# EasyEDA Pro project ProProject_ExtBoard-003_2024-07-01.epro

# Schematic Schematic-CandleLight

## Sheets
1 USB: Create Date: 2024-06-27; Page Name: USB; Project Name: ExtBoard-003; Schematic Name: Schematic-CandleLight; Update Date: 2024-06-27; Company: 嘉立创EDA; Page Size: A4; Version: V1.0
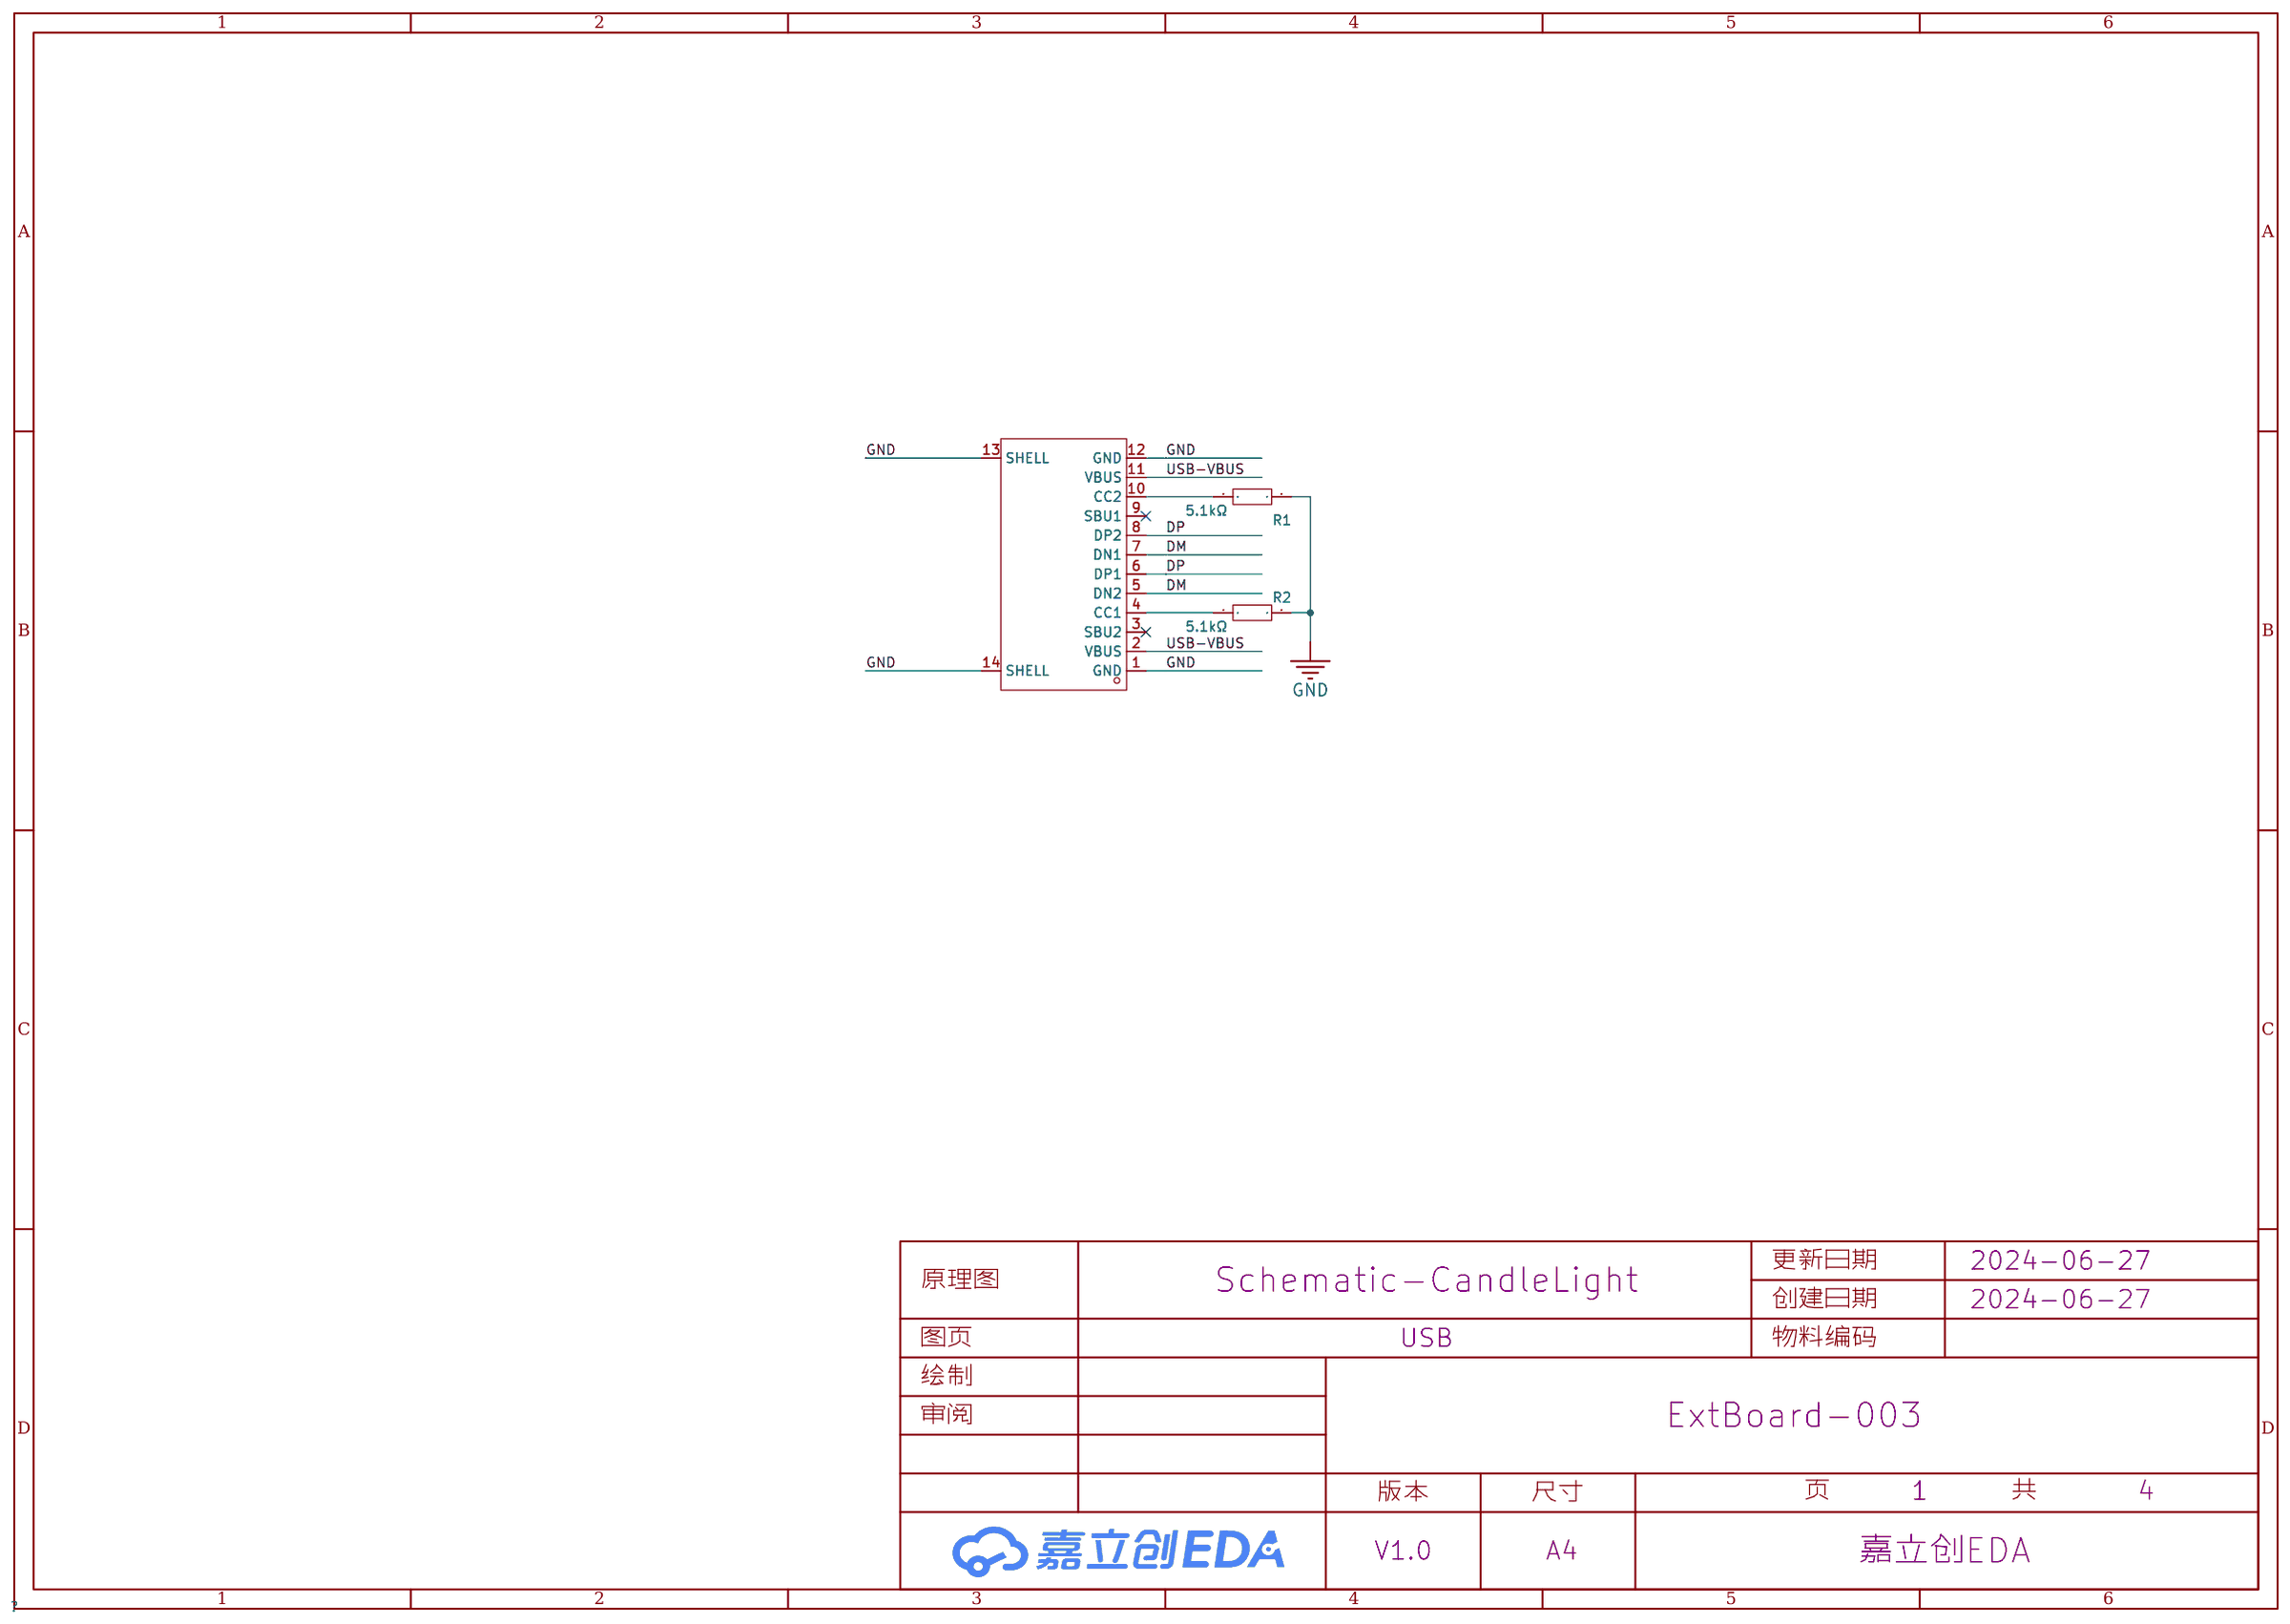
[diagram p0: USB]
2 Power: Page Name: Power
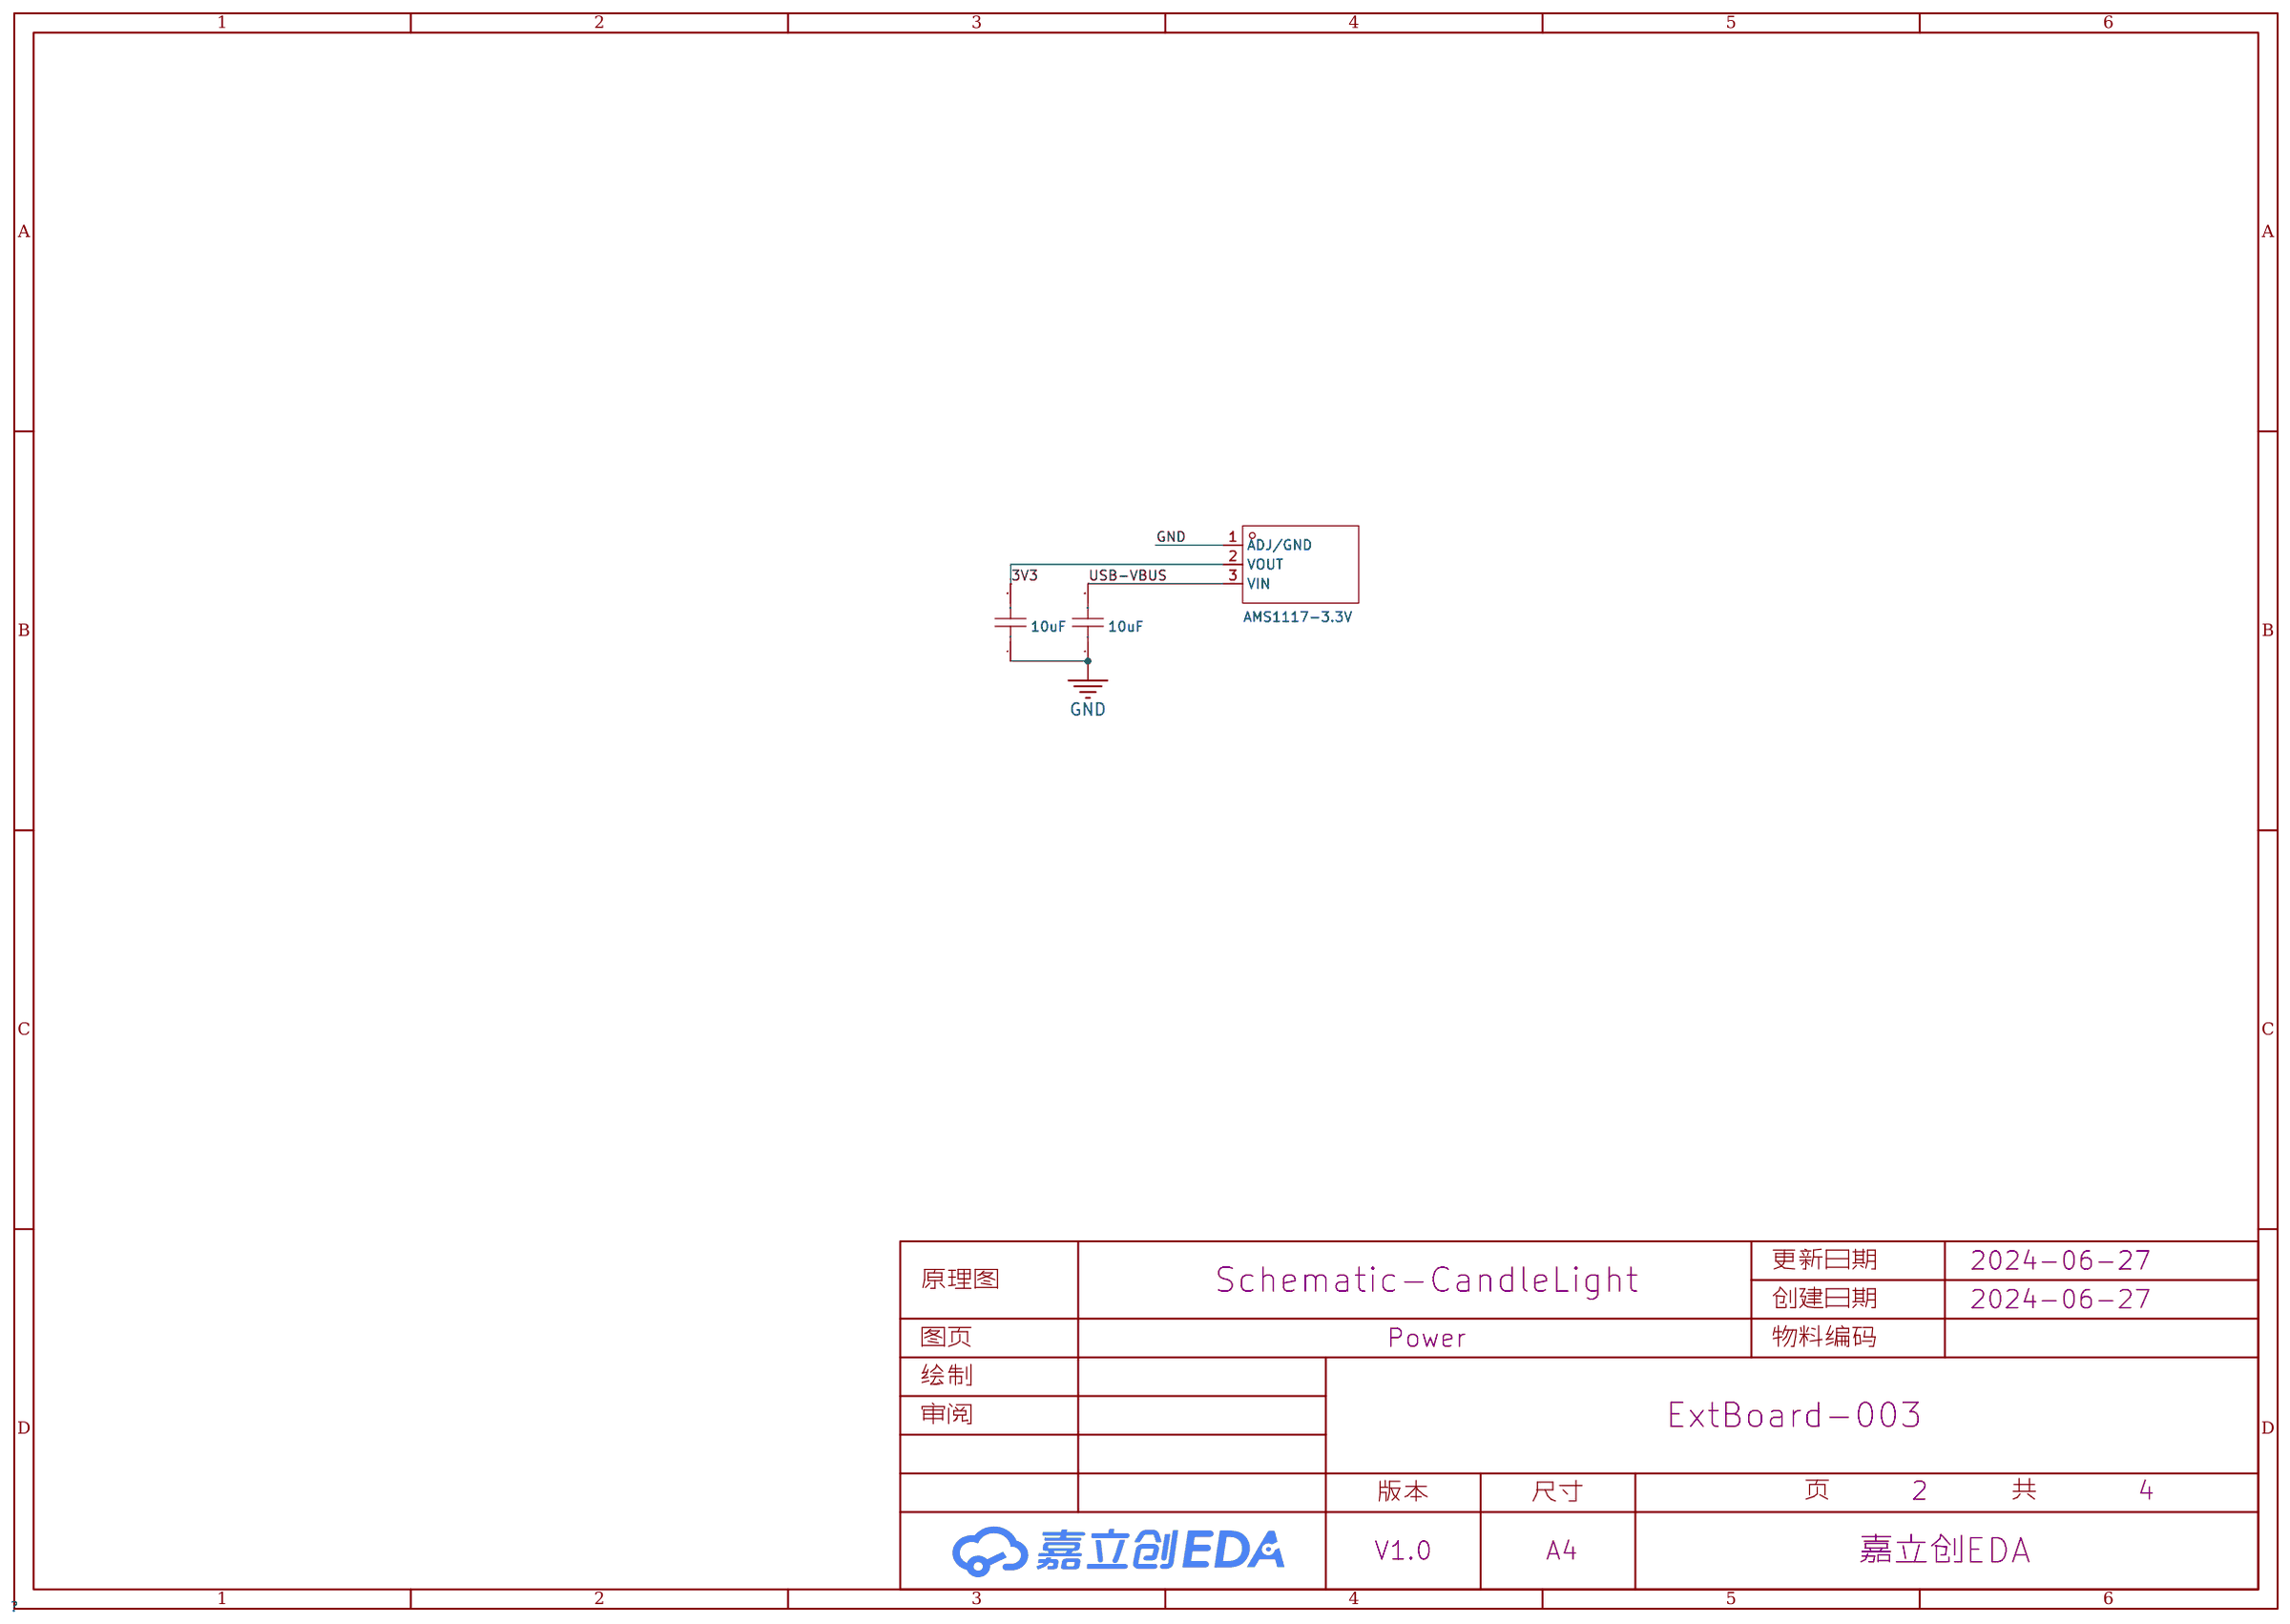
[diagram p1: Power]
3 LED: Page Name: LED
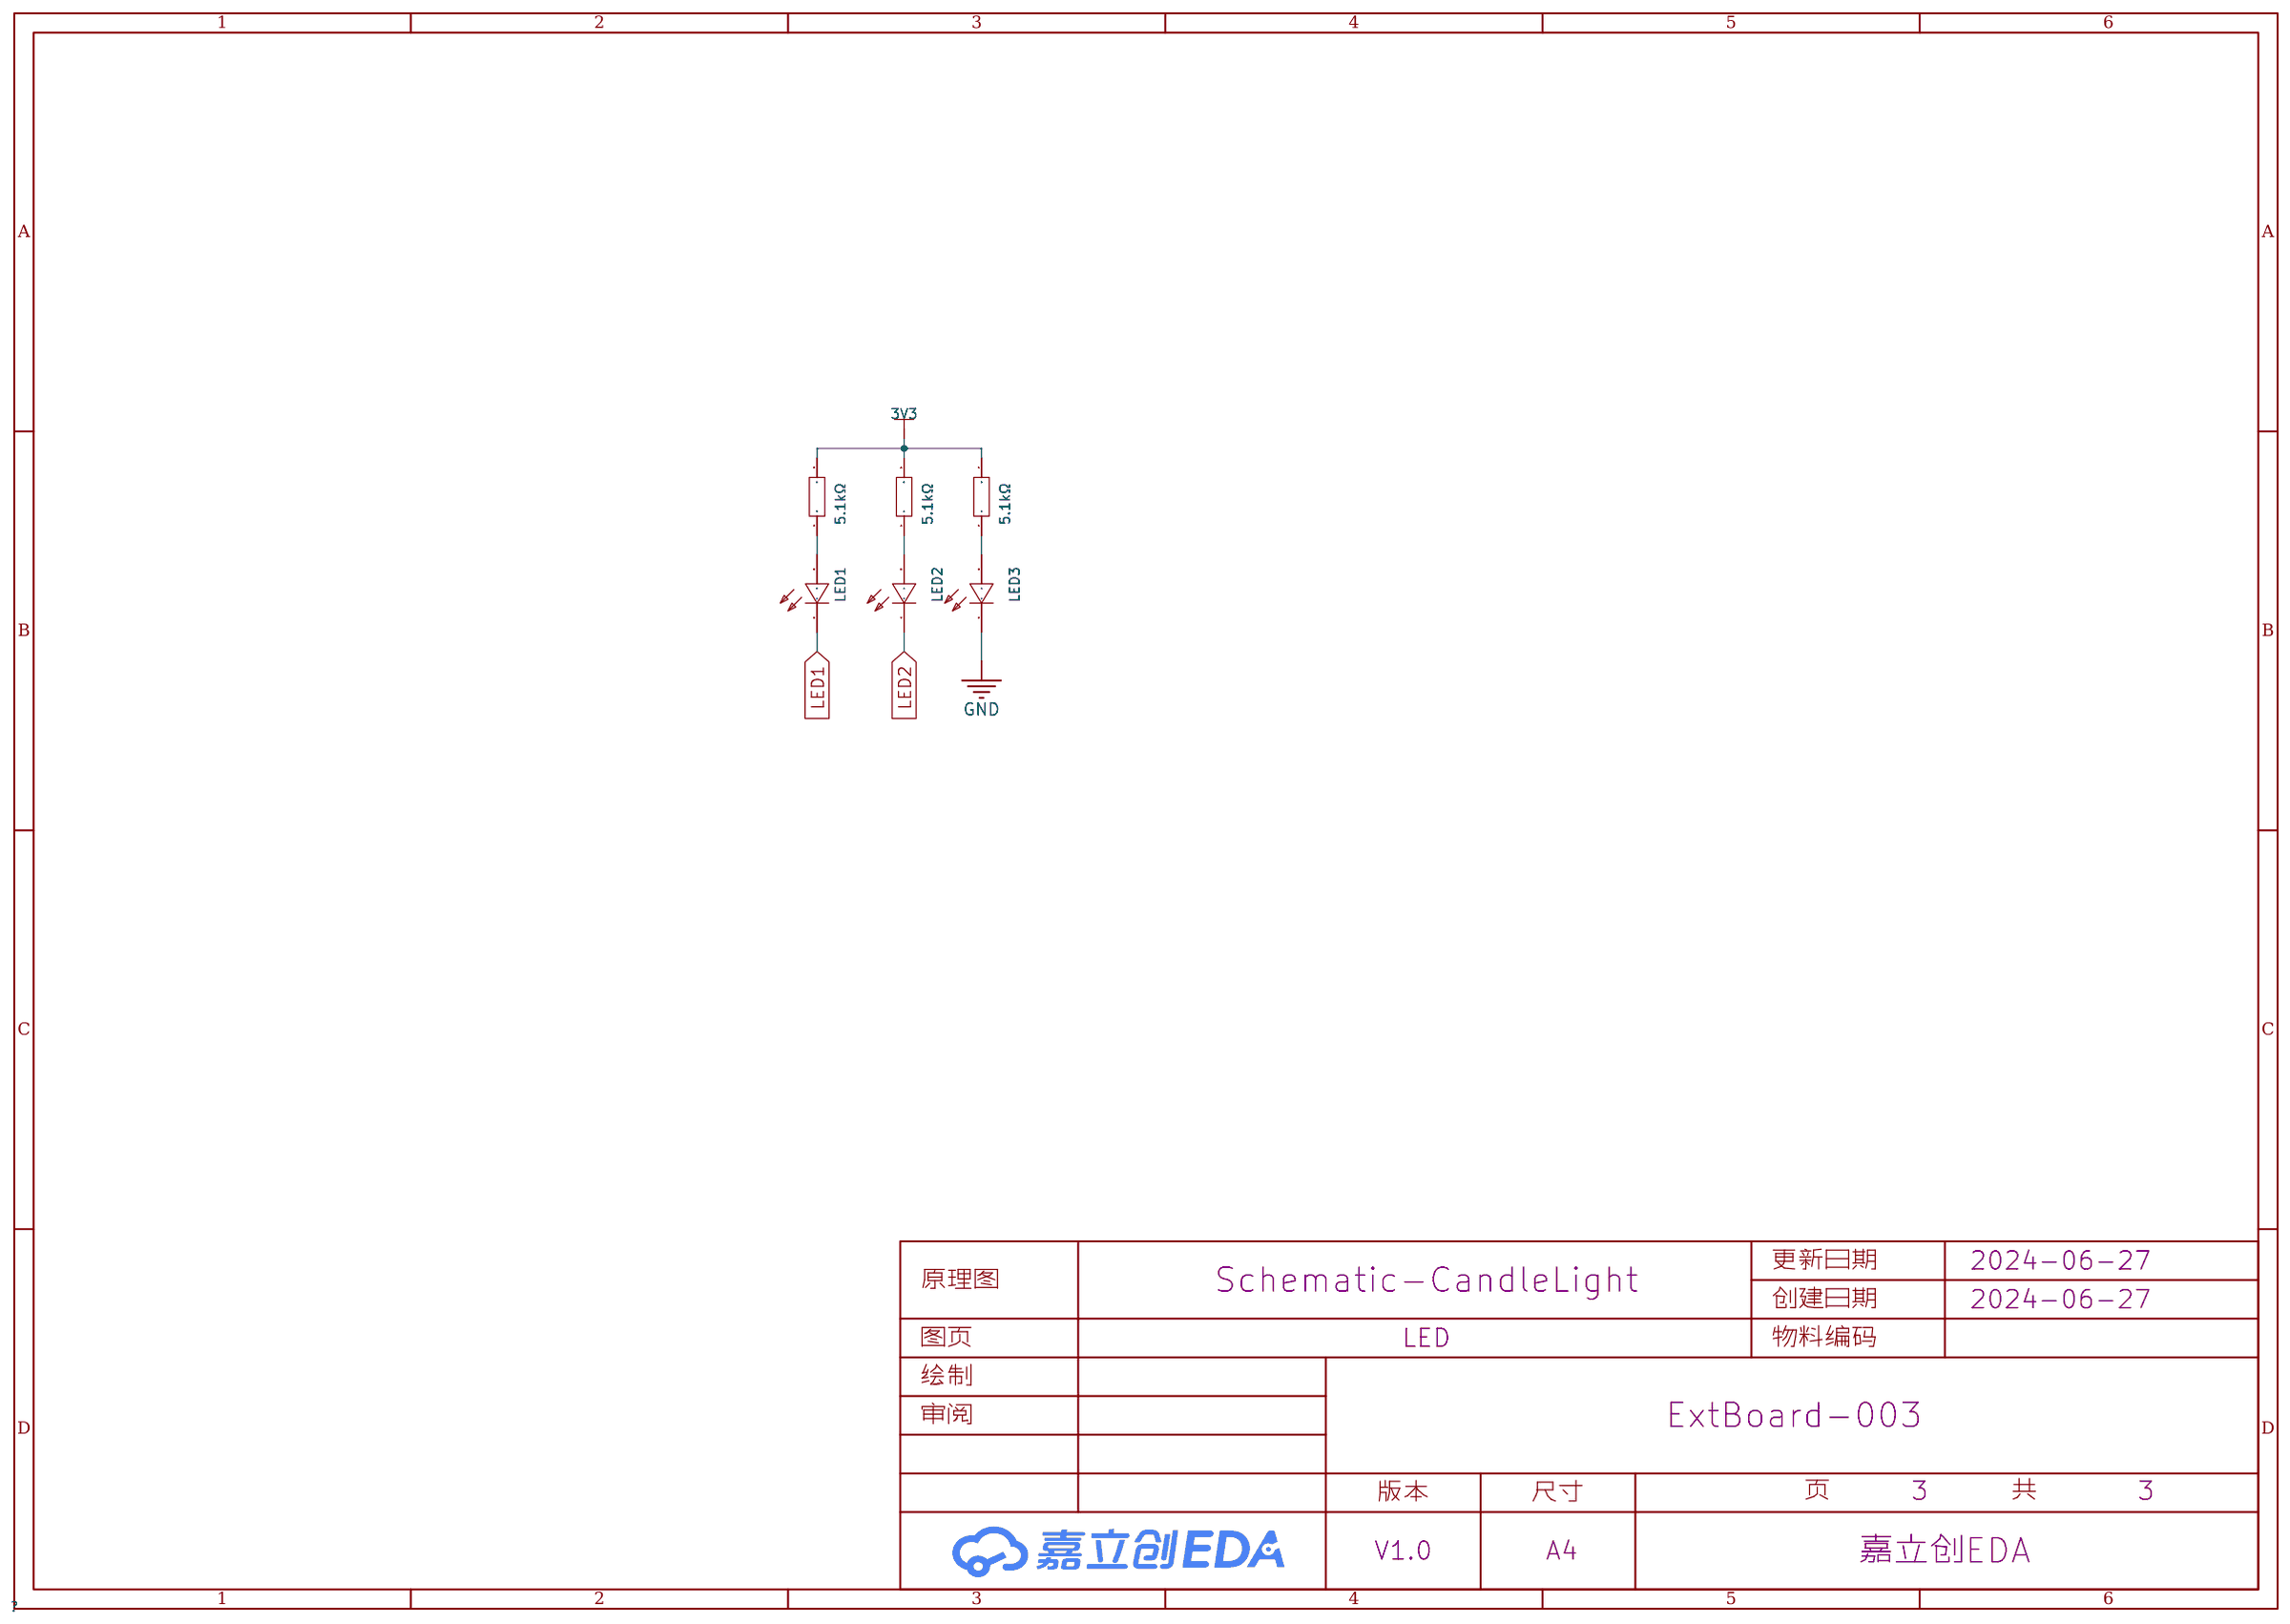
[diagram p2: LED]
4 CAN: Page Name: CAN
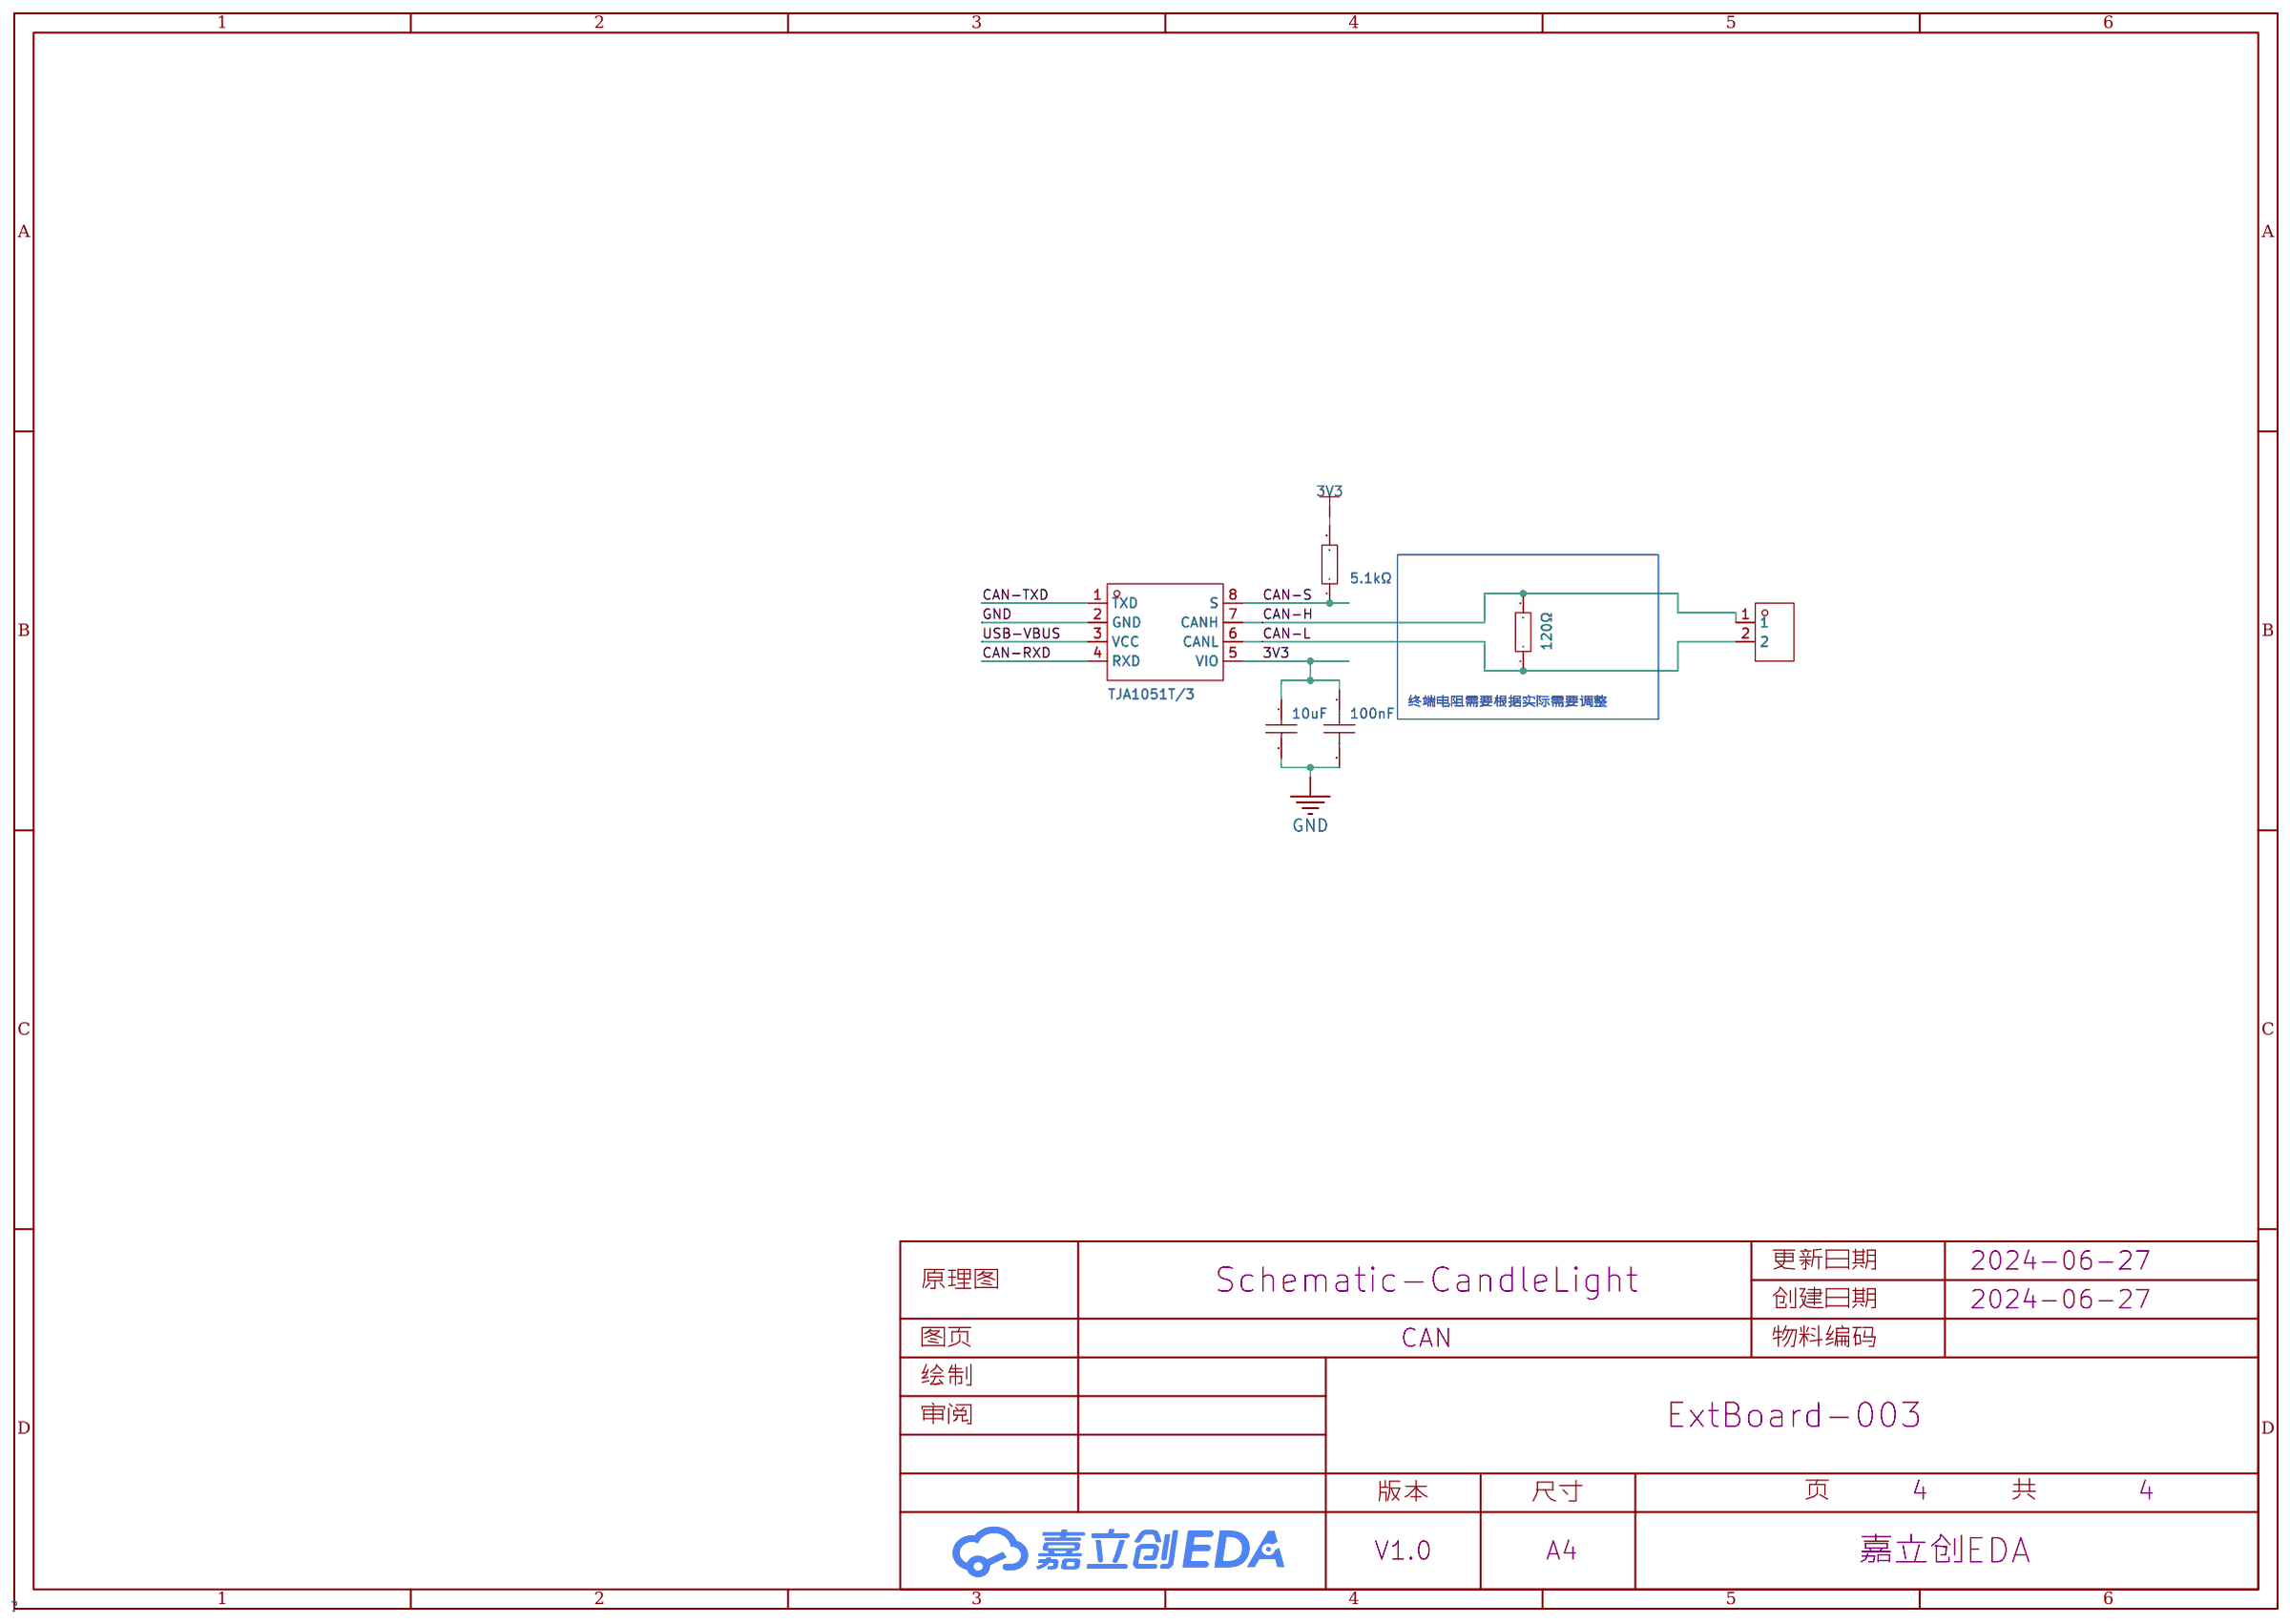
[diagram p3: CAN]
5 MCU: Page Name: MCU
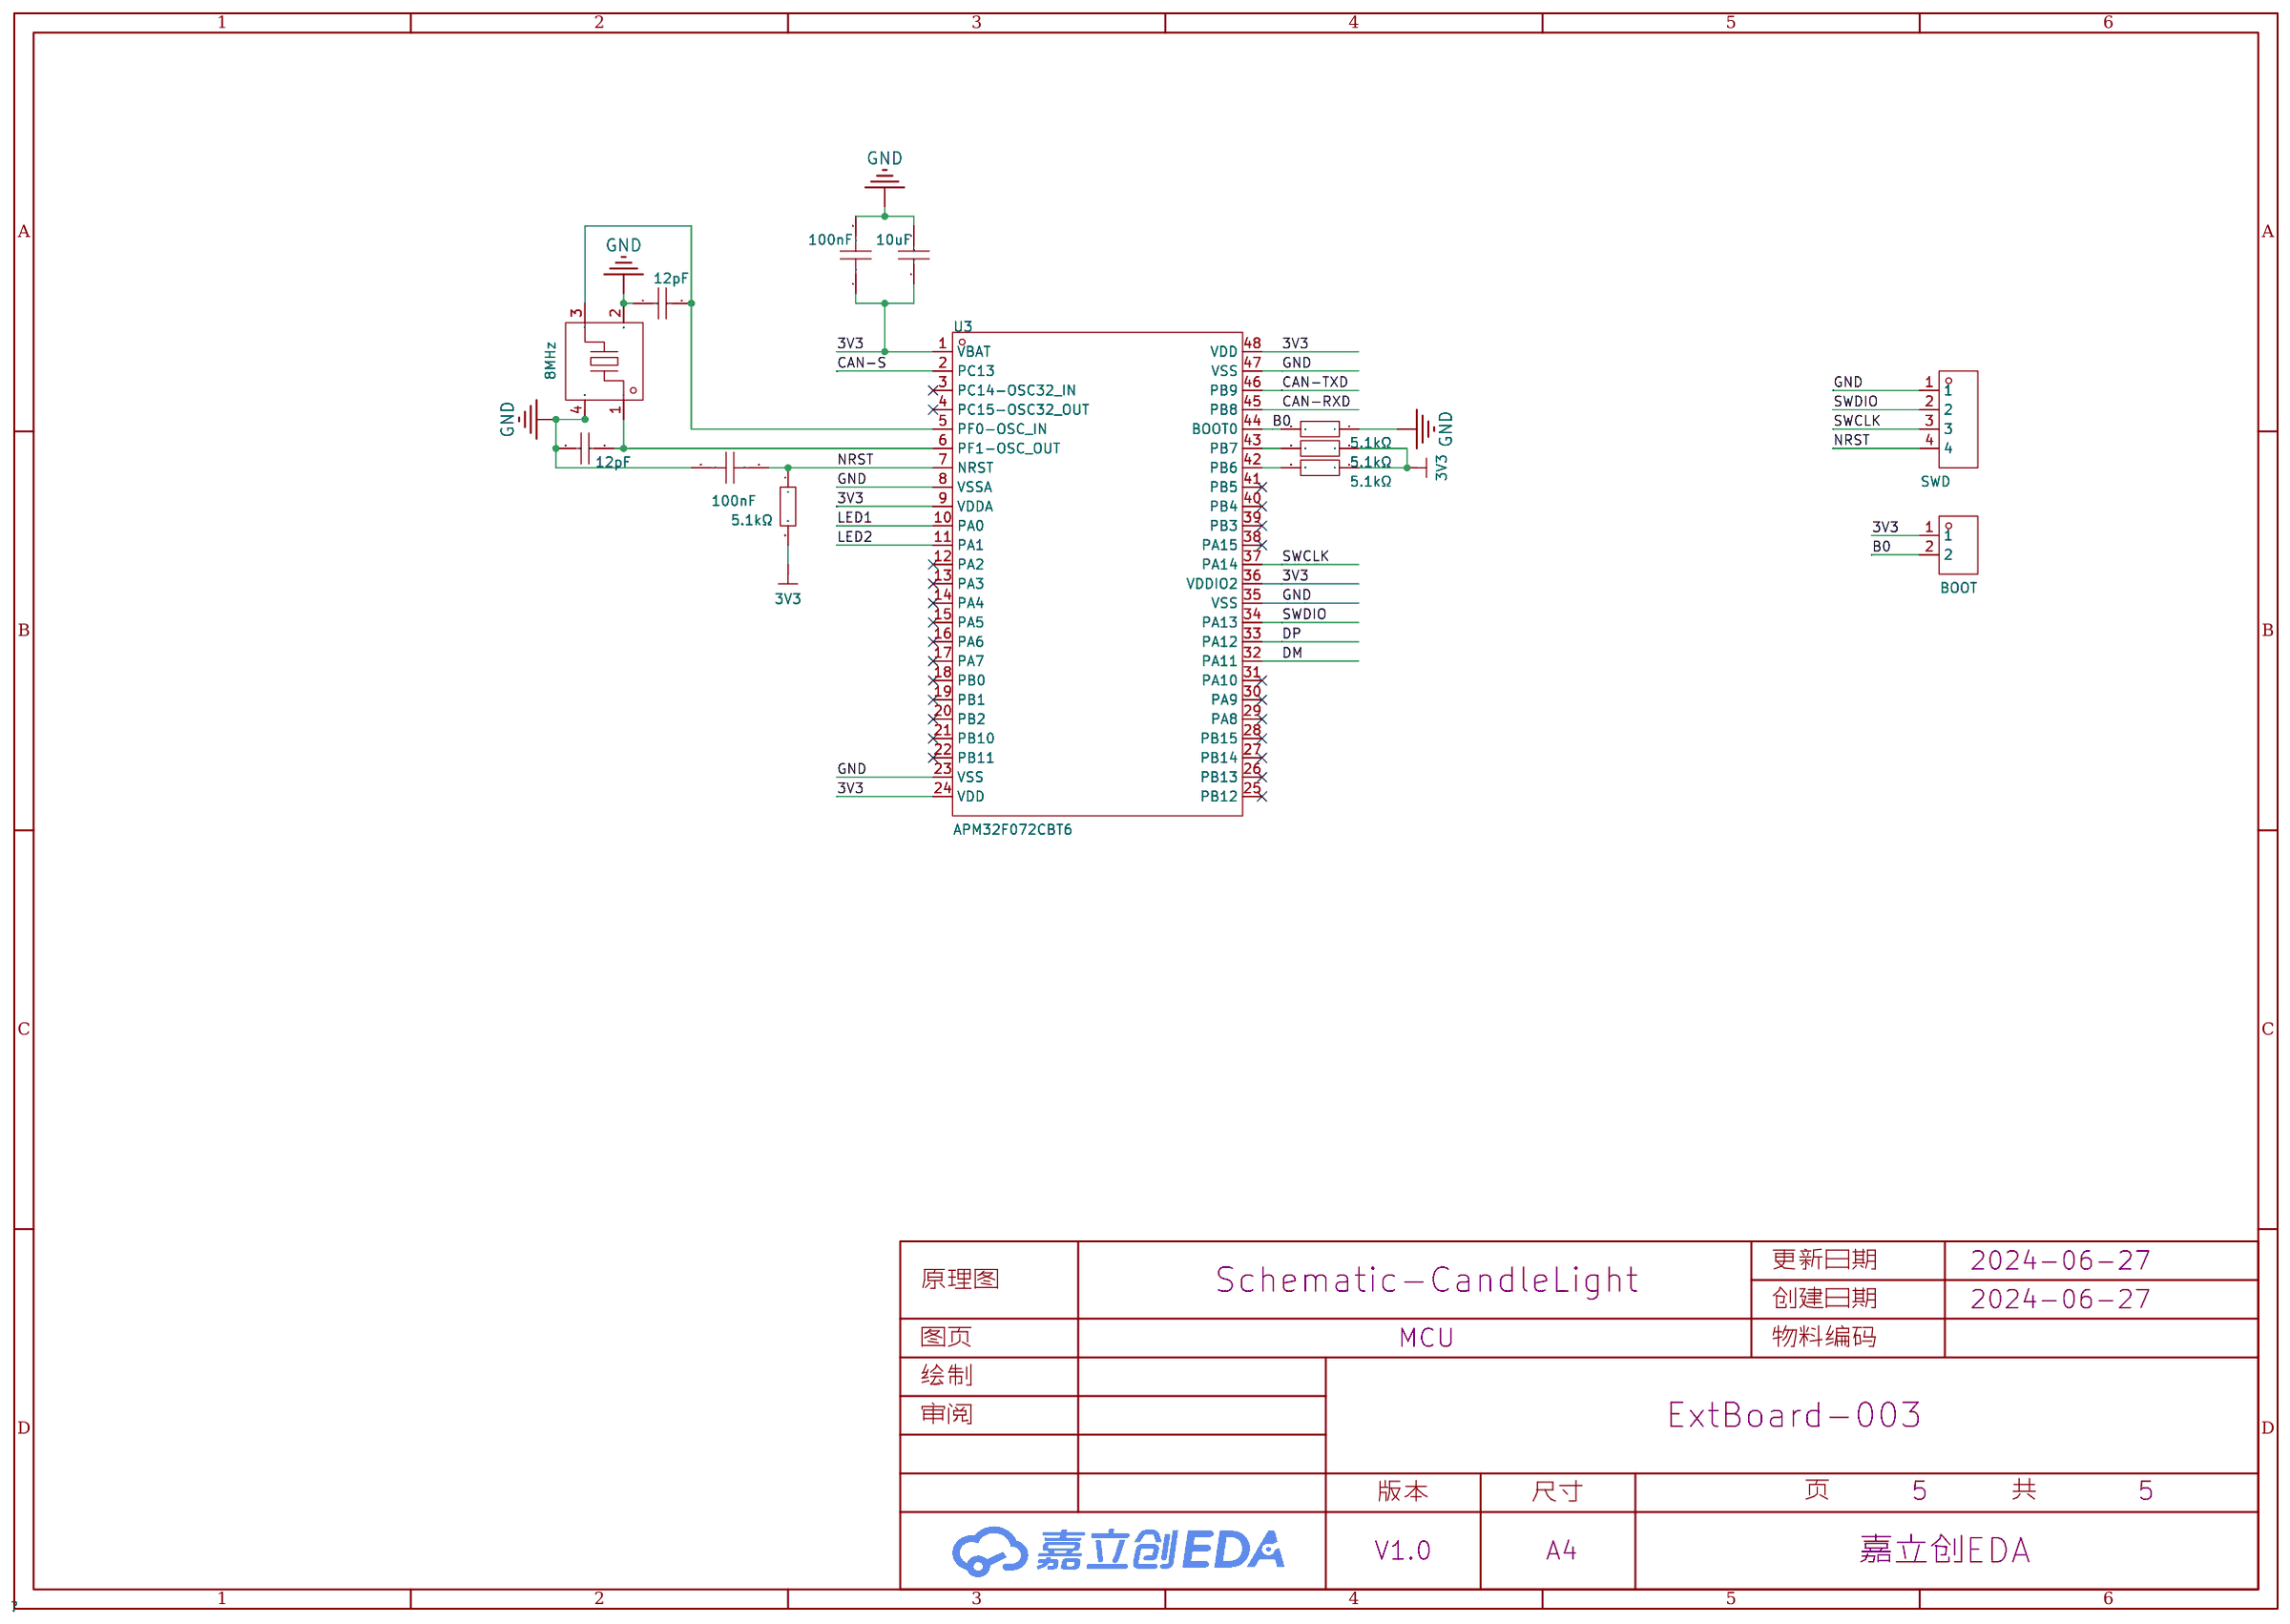
[diagram p4: MCU]

## Parts
sheet CAN
C3  10uF  [C0402]
C4  100nF  [C0402]
R6  5.1kΩ  [R0402]
R7  120Ω  [R1206]
U1  TJA1051T/3  [SOP-8_L4.9-W3.9-P1.27-LS6.0-BL-1]
U2  DB125-3.81-2P-GN-S  [CONN-TH_2P-P3.81_L7.4-W7.6]
sheet LED
LED1  NCD0603R1  [LED0603-RD_RED]
LED2  NCD0603R1  [LED0603-RD_RED]
LED3  NCD0603R1  [LED0603-RD_RED]
R3  5.1kΩ  [R0402]
R4  5.1kΩ  [R0402]
R5  5.1kΩ  [R0402]
sheet MCU
C5  100nF  [C0402]
C6  10uF  [C0402]
C7  12pF  [C0402]
C8  12pF  [C0402]
C9  100nF  [C0402]
H1  SWD  [HDR-TH_4P-P2.54-V-M]
H3  BOOT  [HDR-TH_2P-P1.27-V-M]  (no BOM)
R8  5.1kΩ  [R0402]
R9  5.1kΩ  [R0402]
R10  5.1kΩ  [R0402]
R11  5.1kΩ  [R0402]
U3  APM32F072CBT6  [LQFP-48_L7.0-W7.0-P0.50-LS9.0-BL]
X1  8MHz  [OSC-SMD_4P-L3.2-W2.5-BL]
sheet Power
C1  10uF  [C0402]
C2  10uF  [C0402]
Q1  AMS1117-3.3V  [SOT-89-3_L4.5-W2.5-P1.50-LS4.2-BR]
sheet USB
R1  5.1kΩ  [R0402]
R2  5.1kΩ  [R0402]
USB1  TYPE-C 16PIN 2MD(073)  [USB-C-SMD_TYPE-C-6PIN-2MD-073]

## Library data of the parts
C3 C6 = CL05A106MQ5NUNC: 容值:10uF;精度:±20%;额定电压:6.3V;材质(温度系数):X5R;; LCSC Part Name: 10uF ±20% 6.3V; Supplier Part: C15525; Manufacturer: SAMSUNG(三星); Supplier Footprint: 0402; JLCPCB Part Class: 基础库; Datasheet: https://atta.szlcsc.com/upload/public/pdf/source/20220823/2B02EE04F8F211D38A52DCB16EB6BEBA.pdf; Supplier: LCSC; Tolerance: ±20%; Voltage Rated: 6.3V; Temperature Coefficient: X5R
C4 C5 C9 = CC0402KRX7R7BB104: 容值:100nF;精度:±10%;额定电压:16V;材质(温度系数):X7R;; LCSC Part Name: 100nF ±10% 16V; Supplier Part: C60474; Manufacturer: YAGEO(国巨); Supplier Footprint: 0402; JLCPCB Part Class: Extended Part; Datasheet: https://atta.szlcsc.com/upload/public/pdf/source/20211223/9278FD768280B81DDBEF48FA36411A03.pdf; Supplier: LCSC; Tolerance: ±10%; Voltage Rated: 16V; Temperature Coefficient: X7R
R1-R6 R8-R11 = 0402WGF5101TCE: 阻值:5.1kΩ;精度:±1%;功率:62.5mW;温度系数:±100ppm/℃;电阻类型:厚膜电阻;; LCSC Part Name: 5.1kΩ ±1% 62.5mW 厚膜电阻; Supplier Part: C25905; Manufacturer: UNI-ROYAL(厚声); Supplier Footprint: 0402; JLCPCB Part Class: Basic Part; Datasheet: https://atta.szlcsc.com/upload/public/pdf/source/20200306/C422600_1E6D84923E4A46A82E41ADD87F860B5C.pdf; Supplier: LCSC; Tolerance: ±1%; Power(Watts): 62.5mW; Overload Voltage (Max): 50V; Temperature Coefficient: ±100ppm/℃; Type: 厚膜电阻; Operating Temperature Range: -55℃~+155℃
R7 = 1206W4F1200T5E: 电阻类型:厚膜电阻;阻值:120Ω;精度:±1%;功率:250mW;最大工作电压:200V;温度系数:±100ppm/℃;; LCSC Part Name: 120Ω ±1% 250mW 厚膜电阻; Supplier Part: C17909; Manufacturer: UNI-ROYAL(厚声); Supplier Footprint: 1206; JLCPCB Part Class: 基础库; Datasheet: https://atta.szlcsc.com/upload/public/pdf/source/20200306/C422600_1E6D84923E4A46A82E41ADD87F860B5C.pdf; Supplier: LCSC; Type: 厚膜电阻; Tolerance: ±1%; Power(Watts): 250mW; Overload Voltage (Max): 200V; Temperature Coefficient: ±100ppm/℃; Operating Temperature Range: -55℃~+155℃
U1 = TJA1051T/3: LCSC Part Name: CAN芯片; Supplier Part: C5342108; Manufacturer: Tokmas(托克马斯); Supplier Footprint: SOP-8; JLCPCB Part Class: 扩展库; Datasheet: https://atta.szlcsc.com/upload/public/pdf/source/20221230/A2F88B671123D34174A4F40D8F54A86B.pdf; Supplier: LCSC
U2 = DB125-3.81-2P-GN-S: 结构:1x2P;间距:3.81mm;颜色:绿色;安装方式:直插;额定电流:10A;额定电压:300V;排数:1;线规 - AWG:16~26;线规 - 平方毫米:0.5~1;每排PIN数:2;工作温度范围:-40℃~+105℃;; LCSC Part Name: 3.81mm 1x2P 排数:1 每排P数:2 直插; Supplier Part: C395878; Manufacturer: DORABO(地博电气); Supplier Footprint: 插件,P=3.81mm; JLCPCB Part Class: 扩展库; Datasheet: https://atta.szlcsc.com/upload/public/pdf/source/20220823/CB89165D0F406880B925A92BEEA3FB50.pdf; Supplier: LCSC; Structure: 1x2P; Pitch: 3.81mm; Color: 绿色; Mounting Style: 直插; Current Rating (Max): 10A; Voltage Rating (Max): 300V; Number of Pins: 2P; Number of Rows: 1; Wire Gauge - AWG: 16~26; Wire Gauge - mm2: 0.5~1; Number of PINs Per Row: 2; Operating Temperature Range: -40℃~+105℃
LED1-LED3 = NCD0603R1_C84263: 灯头类型:-;发光颜色:红色;正向电压(VF):1.6V~2.6V;功率:65mW;正向电流:20mA;主波长:615nm~630nm;二极管配置:独立二极管;透镜颜色:无色透明透镜;色温:-;发光强度:80mcd~220mcd;发光角度:130°;载带方式:-;工作温度:-30℃~+85℃;; Supplier Part: C84263; Manufacturer: 国星光电; Supplier Footprint: 0603; JLCPCB Part Class: 扩展库; Datasheet: https://atta.szlcsc.com/upload/public/pdf/source/20200820/C84263_DABC6A75E58F576973B407FDBA283D60.pdf; Supplier: LCSC; Emitted Color: 红色; Forward Voltage (VF): 1.6V~2.6V; Power Dissipation: 65mW; Forward Current: 20mA; Dominant Wavelength: 615nm~630nm; Diode Configuration: 独立二极管; Lens Color: 无色透明透镜; Luminous Intensity: 80mcd~220mcd; Viewing Angle: 130°; Operating Temperature: -30℃~+85℃
C7 C8 = 0402CG120J500NT: 容值:12pF;精度:±5%;额定电压:50V;材质(温度系数):C0G;; LCSC Part Name: 12pF ±5% 50V; Supplier Part: C1547; Manufacturer: FH(风华); Supplier Footprint: 0402; JLCPCB Part Class: 基础库; Datasheet: https://atta.szlcsc.com/upload/public/pdf/source/20200305/C486355_26A10D38EF8C2A5C37091D0039909270.pdf; Supplier: LCSC; Tolerance: ±5%; Voltage Rated: 50V; Temperature Coefficient: C0G
H1 = PZ254V-11-04P: 插针结构:1x4P;间距:2.54mm;行距:-;圆针/方针:方针;安装类型:直插;排数:单排;总PIN位数:4P;额定电流:3A;额定电压:250V;配合针长度:6mm;塑高:2.5mm;端接针长度:3mm;触头材质:-;工作温度范围:-40℃~+105℃;颜色:黑色;; LCSC Part Name: 间距:2.54mm 1x4P 直插 方针; Supplier Part: C2691448; Manufacturer: XFCN(兴飞); Supplier Footprint: 插件,P=2.54mm; JLCPCB Part Class: 扩展库; Datasheet: https://atta.szlcsc.com/upload/public/pdf/source/20200309/C492403_F9F19131791D08044AD4F84F8E751A34.pdf; Supplier: LCSC; Pin Structure: 1x4P; Pitch: 2.54mm; Circluar Pins/Square Pins: 方针; Mounting Type: 直插; Number of Rows: 单排; Number of Pins: 4P; Current Rating (Max): 3A; Voltage Rating (Max): 250V; Length of Mating Pin: 6mm; Insulation Height: 2.5mm; Length of End Connection Pin: 3mm; Operating Temperature Range: -40℃~+105℃; Color: 黑色
H3 = 1.27-1*2P针: 插针结构:1x2P;间距:1.27mm;行距:-;圆针/方针:方针;安装类型:直插;排数:单排;总PIN位数:2P;额定电流:3A;额定电压:-;配合针长度:3mm;塑高:1.7mm;端接针长度:2.5mm;触头材质:黄铜;触头镀层:-;工作温度范围:-55℃~+105℃;颜色:黑色;; LCSC Part Name: 间距:1.27mm 1x2P 直插 方针; Supplier Part: C703015; Manufacturer: BOOMELE(博穆精密); Supplier Footprint: 插件,P=1.27mm; JLCPCB Part Class: 扩展库; Datasheet: https://atta.szlcsc.com/upload/public/pdf/source/20210902/5C150484D45C6948DF4AB04E914DF562.pdf; Supplier: LCSC; Pin Structure: 1x2P; Pitch: 1.27mm; Circluar Pins/Square Pins: 方针; Mounting Type: 直插; Number of Rows: 单排; Number of Pins: 2P; Current Rating (Max): 3A; Length of Mating Pin: 3mm; Insulation Height: 1.7mm; Length of End Connection Pin: 2.5mm; Contact Material: 黄铜; Operating Temperature Range: -55℃~+105℃; Color: 黑色
U3 = APM32F072CBT6: CPU内核:CM0;程序存储容量:128KB;RAM总容量:16KB;GPIO端口数量:37;工作电压范围:2V~3.6V;CPU最大主频:48MHz;程序存储器类型:FLASH;; Supplier Part: C915660; Manufacturer: Geehy(珠海极海); Supplier Footprint: LQFP-48(7x7); JLCPCB Part Class: 扩展库; Datasheet: https://atta.szlcsc.com/upload/public/pdf/source/20201105/C915660_4FC6DFA7AB6BE04AE7EC96004DE2A55F.pdf; Supplier: LCSC; CPU Core: CM0; Program Storage Size: 128KB; RAM Size: 16KB; GPIO Ports Number: 37; Operating Voltage Range: 2V~3.6V; CPU Maximum Speed: 48MHz; Program Memory Type: FLASH; Operating Temperature Range: -40℃~+85℃; ADC (Bit): 12bit; DAC (Bit): 12bit; PWM (Bit): 16bit; 16Bit Timer: 7; 32Bit Timer: 1; CAN: 1; UART/USART: 4; I2C: 2; SPI: 2; Universal Serial Bus: 有; Internal Comparator: 有; Peripheral/Function: 低电压检测；看门狗；CCP捕获/比较；LIN总线协议；触控按键；片载温度传感器；IrDA；CRC校验；DMA；RTC实时时钟; Watchdog: 有; Real-Time Clock: 有; Infrared Data Association: 有; Low-Voltage Detect: 有; CCP Capture/Compare: 有; Direct Memory Access: 有; Internal Oscillator: 有
X1 = X32258MOB4SI: 晶振类型:贴片晶振;频率:8MHz;常温频差:±10ppm;外接负载电容:12pF;频率稳定度(全温):±30ppm;; LCSC Part Name: 8MHz ±10ppm 12pF; Supplier Part: C2682775; Manufacturer: YXC(扬兴晶振); Supplier Footprint: SMD3225-4P; JLCPCB Part Class: 扩展库; Datasheet: https://atta.szlcsc.com/upload/public/pdf/source/20210106/C2682774_0CD4FDA5D9DA3FBEEC23BD607A48E4B0.pdf; Supplier: LCSC; Crystal Type: 贴片晶振; Normal temperature Frequency Tolerance: ±10ppm; External load capacitor: 12pF; Frequency Stability(Full temperature range): ±30ppm; Equivalent Series Resistance (ESR): 150Ω; Operating Temperature: -40℃~+85℃
C1 C2 = GRM155R61A106ME44D: 容值:10uF;精度:±20%;额定电压:10V;材质(温度系数):X5R;; LCSC Part Name: 10uF ±20% 10V; Supplier Part: C77000; Manufacturer: muRata(村田); Supplier Footprint: 0402; Datasheet: https://atta.szlcsc.com/upload/public/pdf/source/20180530/C77000_4866797CFE3A842CD03C597EBD6AE6CD.pdf; Supplier: LCSC; Tolerance: ±20%; Voltage Rated: 10V; Temperature Coefficient: X5R
Q1 = AMS1117-3.3V_C5120796: 输出类型:固定;输出极性:正;最大输入电压:18V;输出电压:3.3V;输出电流:1A;; Supplier Part: C5120796; Manufacturer: MSKSEMI(美森科); Supplier Footprint: SOT-89; Datasheet: https://atta.szlcsc.com/upload/public/pdf/source/20220727/5E62EAC46FFFF83337622C0FBE1B6BF8.pdf; Supplier: LCSC; Output Type: 固定; Output Polarity: 正; Number of Outputs: 1; Maximum Input Voltage: 18V; Output Voltage: 3.3V; Dropout Voltage: 1.4V@(1A); Quiescent Current (Ground Current): 12mA; Output Current: 1A; Operating Temperature: 0℃~+125℃
USB1 = TYPE-C 16PIN 2MD(073): 连接器类型:Type-C;标准:-;公母:母;端口数量:1;触点数量:16P;安装方式:卧贴;额定电流 - 电源:5A;工作温度范围:-25℃~+85℃;; LCSC Part Name: Type-C 母 卧贴 带定位柱 不锈钢外壳 2次模顶; Supplier Part: C2765186; Manufacturer: SHOU HAN(首韩); Supplier Footprint: SMD; JLCPCB Part Class: 扩展库; Datasheet: https://atta.szlcsc.com/upload/public/pdf/source/20211123/39B17C16241EAC15C5E277BDA434118E.pdf; Supplier: LCSC; Connector Type: Type-C; Gender: 母; Number of Ports: 1; Number of Contacts: 16P; Mounting Style: 卧贴; Current Rating - Power (Max): 5A; Operating Temperature Range: -25℃~+85℃

## Nets
3V3: C1.2 C3.1 C4.1 C5.1 C6.1 H3.1 Q1.2(VOUT) R3.2 R4.2 R5.2 R6.2 R9.1 R10.1 R11.2 U1.5(VIO) U3.1(VBAT) U3.9(VDDA) U3.24(VDD) U3.36(VDDIO2) U3.48(VDD)
GND: C1.1 C2.1 C3.2 C4.2 C5.2 C6.2 C7.1 C8.1 C9.2 H1.1 LED3.1(K) Q1.1(ADJ/GND) R1.2 R2.2 R8.1 U1.2(GND) U3.8(VSSA) U3.23(VSS) U3.35(VSS) U3.47(VSS) USB1.1(GND) USB1.12(GND) USB1.13(SHELL) USB1.14(SHELL) X1.2(GND) X1.4(GND)
B0: H3.2 R8.2 U3.44(BOOT0)
CAN-H: R7.2 U1.7(CANH) U2.1
CAN-L: R7.1 U1.6(CANL) U2.2
CAN-RXD: U1.4(RXD) U3.45(PB8)
CAN-S: R6.1 U1.8(S) U3.2(PC13)
CAN-TXD: U1.1(TXD) U3.46(PB9)
DM: U3.32(PA11) USB1.5(DN2) USB1.7(DN1)
DP: U3.33(PA12) USB1.6(DP1) USB1.8(DP2)
LED1: LED1.1(K) U3.10(PA0)
LED2: LED2.1(K) U3.11(PA1)
NRST: C9.1 H1.4 R11.1 U3.7(NRST)
SWCLK: H1.3 U3.37(PA14)
SWDIO: H1.2 U3.34(PA13)
USB-VBUS: C2.2 Q1.3(VIN) U1.3(VCC) USB1.2(VBUS) USB1.11(VBUS)
$1N217: R1.1 USB1.10(CC2)
$1N218: R2.1 USB1.4(CC1)
$3N372: LED1.2(A) R3.1
$3N375: LED2.2(A) R4.1
$3N378: LED3.2(A) R5.1
$5N578: C7.2 U3.5(PF0-OSC_IN) X1.3
$5N591: C8.2 U3.6(PF1-OSC_OUT) X1.1
$5N836: R9.2 U3.43(PB7)
$5N839: R10.2 U3.42(PB6)

Not connected (* = marked no-connect by the designer): U3 3(PC14-OSC32_IN)* 4(PC15-OSC32_OUT)* 12(PA2)* 13(PA3)* 14(PA4)* 15(PA5)* 16(PA6)* 17(PA7)* 18(PB0)* 19(PB1)* 20(PB2)* 21(PB10)* 22(PB11)* 25(PB12)* 26(PB13)* 27(PB14)* 28(PB15)* 29(PA8)* 30(PA9)* 31(PA10)* 38(PA15)* 39(PB3)* 40(PB4)* 41(PB5)*; USB1 3(SBU2)* 9(SBU1)*

## Notes on the sheets
sheet 4
- 终端电阻需要根据实际需要调整

# Board PCB-CandleLight
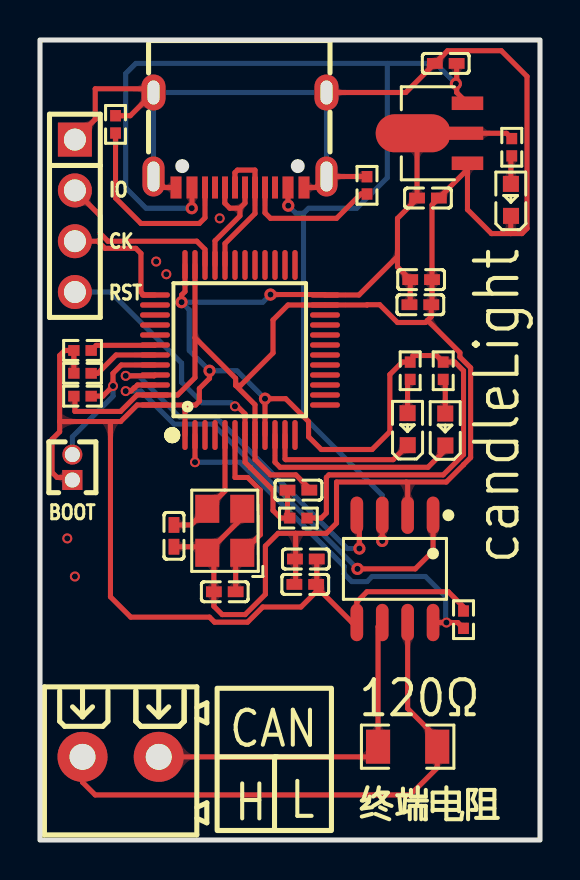
[diagram p5: board, top side]
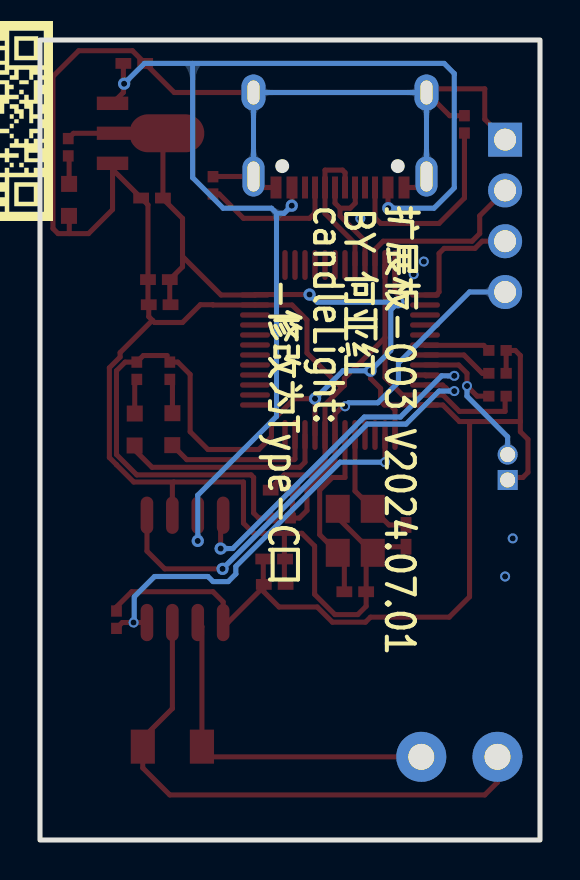
[diagram p6: board, bottom side, seen from below]

Outline 25 x 40 mm; copper layers: Top Layer, Bottom Layer. Coordinates in mm from the lower left corner of the outline.
Outline path: rectangle 0,40 25,0
Stack: Top Layer 0.035mm / Dielectric1 1.51mm FR4 er 4.5 / Bottom Layer 0.035mm

## Design rules (mm)
template: JLCPCB Capability(Two Layers Board)
spacing copperThickness1oz (default): track to track 0.102, other pairs 0.152 to 0.3
spacing copperThickness2oz: track to track 0.203, other pairs 0.152 to 0.3
track width copperThickness1oz (default): min 0.127, default 0.254, max 2.54
track width copperThickness2oz: min 0.203, default 0.254, max 2.54
differential pair differentialPair (default): width min 0.127, default 0.254, max 2.54; gap min 0.152, default 0.152
via viaSize (default): diameter min 0.5, default 0.61, max 10; hole min 0.3, default 0.305, max 6.3

## Placement (name value [footprint] x y rotation side)
C1  10uF  [C0402]  19.4 32.1 180 top
C2  10uF  [C0402]  20.29 38.83 0 top
C3  10uF  [C0402]  13.26 12.78 180 top
C4  100nF  [C0402]  13.29 14.05 180 top
C5  100nF  [C0402]  19.06 28.02 0 top
C6  10uF  [C0402]  19.02 26.76 0 top
C7  12pF  [C0402]  6.7 15.21 90 top
C8  12pF  [C0402]  9.24 12.41 0 top
C9  100nF  [C0402]  12.92 17.49 0 top
H1  SWD  [HDR-TH_4P-P2.54-V-M]  1.75 31.21 270 top
H3  BOOT  [HDR-TH_2P-P1.27-V-M]  1.62 18.64 90 top
LED1  NCD0603R1  [LED0603-RD_RED]  20.27 20.53 90 top
LED2  NCD0603R1  [LED0603-RD_RED]  18.38 20.54 90 top
LED3  NCD0603R1  [LED0603-RD_RED]  23.55 32.01 90 top
Q1  AMS1117-3.3V  [SOT-89-3_L4.5-W2.5-P1.50-LS4.2-BR]  20.02 35.34 0 top
R1  5.1kΩ  [R0402]  3.78 35.78 90 top
R2  5.1kΩ  [R0402]  16.35 32.73 90 top
R3  5.1kΩ  [R0402]  20.16 23.46 90 top
R4  5.1kΩ  [R0402]  18.51 23.46 90 top
R5  5.1kΩ  [R0402]  23.59 34.64 90 top
R6  5.1kΩ  [R0402]  21.18 11.02 90 top
R7  120Ω  [R1206]  18.38 4.67 0 top
R8  5.1kΩ  [R0402]  2.13 22.19 0 top
R9  5.1kΩ  [R0402]  2.13 23.33 0 top
R10  5.1kΩ  [R0402]  2.13 24.48 0 top
R11  5.1kΩ  [R0402]  12.92 16.1 0 top
U1  TJA1051T/3  [SOP-8_L4.9-W3.9-P1.27-LS6.0-BL-1]  17.75 13.56 180 top
U2  DB125-3.81-2P-GN-S  [CONN-TH_2P-P3.81_L7.4-W7.6]  4.03 4.16 0 top
U3  APM32F072CBT6  [LQFP-48_L7.0-W7.0-P0.50-LS9.0-BL]  10 24.5 0 top
USB1  TYPE-C 16PIN 2MD(073)  [USB-C-SMD_TYPE-C-6PIN-2MD-073]  10 35 180 top
X1  8MHz  [OSC-SMD_4P-L3.2-W2.5-BL]  9.24 15.46 90 top

## Footprints (pads in the part's own frame, mm; a bottom-side part is the same pattern mirrored in y, then rotated)
C0402
  rect 0.79x0.54 smd: 1(-0.545,0) 2(0.545,0)
CONN-TH_2P-P3.81_L7.4-W7.6
  round 2.5 hole 1.3: 1(-1.905,0) 2(1.905,0)
HDR-TH_2P-P1.27-V-M
  rect 1x1 hole 0.75: 1(-0.635,0)
  round 1 hole 0.75: 2(0.635,0)
HDR-TH_4P-P2.54-V-M
  rect 1.7x1.7 hole 1.1: 1(-3.81,0)
  round 1.7 hole 1.1: 2(-1.27,0) 3(1.27,0) 4(3.81,0)
LED0603-RD_RED
  rect 0.8x0.8 smd: 1(-0.799,-0.004) 2(0.799,0.004)
LQFP-48_L7.0-W7.0-P0.50-LS9.0-BL
  oval 0.27x1.5 smd: 1(-2.75,-4.25) 2(-2.25,-4.25) 3(-1.75,-4.25) 4(-1.25,-4.25) 5(-0.75,-4.25) 6(-0.25,-4.25) 7(0.25,-4.25) 8(0.75,-4.25) 9(1.25,-4.25) 10(1.75,-4.25) 11(2.25,-4.25) 12(2.75,-4.25) 25(2.75,4.25) 26(2.25,4.25) 27(1.75,4.25) 28(1.25,4.25) 29(0.75,4.25) 30(0.25,4.25) 31(-0.25,4.25) 32(-0.75,4.25) 33(-1.25,4.25) 34(-1.75,4.25) 35(-2.25,4.25) 36(-2.75,4.25)
  oval 1.5x0.27 smd: 13(4.25,-2.75) 14(4.25,-2.25) 15(4.25,-1.75) 16(4.25,-1.25) 17(4.25,-0.75) 18(4.25,-0.25) 19(4.25,0.25) 20(4.25,0.75) 21(4.25,1.25) 22(4.25,1.75) 23(4.25,2.25) 24(4.25,2.75) 37(-4.25,2.75) 38(-4.25,2.25) 39(-4.25,1.75) 40(-4.25,1.25) 41(-4.25,0.75) 42(-4.25,0.25) 43(-4.25,-0.25) 44(-4.25,-0.75) 45(-4.25,-1.25) 46(-4.25,-1.75) 47(-4.25,-2.25) 48(-4.25,-2.75)
OSC-SMD_4P-L3.2-W2.5-BL
  rect 1.4x1.2 smd: 1(-1.1,-0.875) 2(1.1,-0.875) 3(1.1,0.875) 4(-1.1,0.875)
R0402
  rect 0.566x0.54 smd: 1(-0.433,0) 2(0.433,0)
R1206
  rect 1.208x1.701 smd: 1(-1.479,0) 2(1.479,0)
SOP-8_L4.9-W3.9-P1.27-LS6.0-BL-1
  oval 0.63x1.865 smd: 1(-1.905,-2.683) 2(-0.635,-2.683) 3(0.635,-2.683) 4(1.905,-2.683) 5(1.905,2.683) 6(0.635,2.683) 7(-0.635,2.683) 8(-1.905,2.683)
SOT-89-3_L4.5-W2.5-P1.50-LS4.2-BR
  rect 1.575x0.672 smd: 1(1.356,-1.5) 3(1.356,1.5)
  custom 5.377x1.9 smd: 2(-1.356,0)
USB-C-SMD_TYPE-C-6PIN-2MD-073
  rect 0.55x1.1 smd: 1(-3.2,2.375) 2(-2.4,2.375) 11(2.4,2.375) 12(3.2,2.375)
  rect 0.3x1.1 smd: 3(-1.75,2.375) 4(-1.25,2.375) 5(-0.75,2.375) 6(-0.25,2.375) 7(0.25,2.375) 8(0.75,2.375) 9(1.25,2.375) 10(1.75,2.375)
  oval 1.1x2 hole 0.6x1.5: 13(-4.325,1.825) 14(4.325,1.825)
  oval 1.2x1.8 hole 0.6x1.2: 13(-4.325,-2.375) 14(4.325,-2.375)

## Nets
As in the schematic.

Pads without a net: U3 3 4 12 13 14 15 16 17 18 19 20 21 22 25 26 27 28 29 30 31 38 39 40 41; USB1 3 9

## Via types
v1: diameter 0.5, hole 0.305, Top Layer to Bottom Layer, 11 vias
v2: diameter 0.61, hole 0.305, Top Layer to Bottom Layer, 10 vias

## Routing (per net, layer and track width the routed paths; a pad name or vN(x,y) marks a point on that pad's centre or on a via; arc(x,y) is an arc through that point)
3V3: length 118.4
  Top Layer w0.254: v2(8.48,23.46) 8.48,23.08 7.97,22.57 7.97,21.94 7.78,21.75 7.5,21.75 ; 0.98,20.92 0.98,24.22 1.24,24.48 R10.1 R9.1 ; 0.98,20.92 0.98,20.41 0.6,20.03 0.6,18.38 0.86,18.13 1.49,18.13 H3.1 ; 0.98,20.92 3.43,20.92 ; 17.87,29.18 17.87,28.66 C5.1 18.51,26.8 C6.1 ; 17.87,29.18 15.95,27.25 U3.24 14.23,27.27 v2(11.52,27.27) ; 17.87,29.18 17.87,31.08 18.85,32.06 C1.2 18.85,35.14 Q1.2 23.32,35.34 R5.2 ; 13.68,12.79 13.81,12.67 ; 13.81,12.67 15.6,10.87 U1.5 15.84,11.91 16.35,12.41 20.41,12.41 21.18,11.65 21.18,11.45 ; 13.81,12.67 13.81,12.41 13.05,11.65 11.14,11.65 10.38,10.89 8.73,10.89 8.48,11.14 4.54,11.14 3.52,12.16 3.52,20.83 3.43,20.92 ; U3.1 7.25,21.5 7.5,21.75 ; v2(7.08,26.89) 7.08,27.25 7.25,27.42 U3.36 ; R11.2 14.06,16.1 14.32,16.35 14.32,18.13 14.44,18.25 20.16,18.25 21.18,19.27 21.18,23.46 20.74,23.89 R3.2 19.83,24.22 18.64,24.22 ; C4.1 13.84,12.81 C3.1 ; 7.5,21.75 U3.48 4.86,21.75 4.03,20.92 3.43,20.92 ; R4.2 18.11,23.89 17.49,23.28 17.49,20.41 16.6,19.53 14.06,19.53 13.43,20.16 13.43,20.92 12.29,22.06 v2(11.25,22.06) U3.9
  Bottom Layer w0.254: v2(11.52,27.27) 11.14,26.89 v2(7.08,26.89) 7.46,26.51 7.46,24.48 v2(8.48,23.46) 9.85,23.46 v2(11.25,22.06)
GND: length 139.3
  Top Layer w0.254: 23.54,30.32 24.1,30.32 24.35,30.57 24.35,38.18 23.06,39.46 20.38,39.46 C2.1 18.29,37.38 USB1.13 ; 23.54,30.32 23.54,31.19 LED3.1 ; 23.54,30.32 22.57,30.32 21.37,31.52 21.37,33.53 ; C9.2 13.47,17.58 12.79,18.25 11.52,18.25 10.75,19.03 U3.8 10.75,21.76 9.78,22.73 ; C7.1 8.06,14.66 X1.4 ; R8.1 1.75,22.14 1.75,21.43 4.03,21.43 4.85,22.25 U3.47 6.88,22.25 7.75,23.12 7.75,25.11 ; 7.75,25.11 9.78,23.08 9.78,22.73 ; 7.75,25.11 U3.35 ; USB1.14 6.22,32.62 USB1.12 ; 19.38,25.98 19.27,25.88 17.87,25.88 16.99,26.76 16.36,26.76 16.35,26.75 U3.23 12.4,26.75 11.65,26 11.65,24.35 10.03,22.73 9.78,22.73 ; 19.38,25.98 21,24.37 21,24.15 21.53,23.61 21.53,19.12 21.18,18.77 21.18,18.76 20.31,17.9 18.31,17.9 ; 19.38,25.98 19.56,26.17 C6.2 19.6,26.8 C5.2 19.6,31.76 21.37,33.53 ; 21.37,33.53 Q1.1 ; U1.2 18.38,17.83 18.31,17.9 ; R2.2 16.34,33.17 USB1.13 13.78,32.62 USB1.1 ; 18.31,17.9 14.83,17.9 14.83,15.84 14.32,15.33 12.78,15.33 ; X1.4 10.11,16.11 X1.2 ; X1.4 8.69,14.03 C8.1 8.69,11.69 9.11,11.27 10.25,11.27 11.27,12.29 11.27,14.7 11.91,15.33 12.78,15.33 ; 12.78,15.33 12.78,14.08 ; 12.78,14.08 C4.2 ; 12.78,14.08 12.78,12.84 C3.2 ; R1.2 4.51,36.21 USB1.14 5.49,37.56 2.76,37.56 2.76,36.03 H1.1
  Bottom Layer w0.254: USB1.14 USB1.14 USB1.13 USB1.13
  vias: v1(1.36,15.08) v1(1.75,13.17) v1(5.81,28.92) v1(6.32,28.29) v1(8.98,31.08)
B0: length 8.5
  Top Layer w0.254: R8.2 3.14,22.19 v1(3.65,22.7) 3.65,23.33 4.06,23.75 U3.44
  Bottom Layer w0.254: v1(3.65,22.7) 3.65,22.19 1.62,20.16 H3.2
CAN-H: length 27.7
  Top Layer w0.254: U2.1 2.13,2.89 2.76,2.25 18.51,2.25 19.86,3.61 19.86,5.09 18.38,6.57 U1.7
CAN-L: length 17.5
  Top Layer w0.254: U2.2 16.4,4.16 R7.1 16.9,10.67 U1.6
CAN-RXD: length 18.5
  Top Layer w0.254: v1(4.28,23.21) 5.71,23.21 U3.45 ; v2(15.97,14.57) 15.97,16.11 U1.4
  Bottom Layer w0.254: v2(15.97,14.57) 15.36,14.57 8.78,21.15 6.98,21.15 4.92,23.21 v1(4.28,23.21)
CAN-S: length 20
  Top Layer w0.254: R6.1 20.89,10.87 v1(20.32,10.87) U1.8 ; U3.2 v1(7.75,18.89)
  Bottom Layer w0.254: v1(7.75,18.89) 10,18.89 15.21,13.68 15.21,13.3 15.59,12.92 16.35,12.92 16.6,13.17 19.27,13.17 20.29,12.16 20.29,10.89
CAN-TXD: length 23
  Top Layer w0.254: U3.46 4.87,22.75 4.73,22.61 4.7,22.61 4.54,22.45 v1(4.28,22.45) ; U1.1 19.65,14.44 18.76,13.56 15.72,13.56
  Bottom Layer w0.254: v2(15.87,13.56) 8.63,20.8 6.7,20.8 5.05,22.45 v1(4.28,22.45)
DM: length 7.2
  Top Layer w0.254: USB1.7 9.75,32.63 9.75,33.37 9.87,33.5 10.75,33.5 USB1.5 10.75,31.32 9.25,29.82 U3.32
DP: length 6.1
  Top Layer w0.254: 10,31.59 10,31.2 8.75,29.96 U3.33 ; 10,31.59 9.49,31.59 9.24,31.84 9.24,32.61 USB1.8 ; 10,31.59 10.25,31.84 USB1.6
LED1: length 10.6
  Top Layer w0.254: 20.27,19.72 20.27,19.51 19.4,18.64 12,18.64 11.75,18.89 U3.10
LED2: length 7.6
  Top Layer w0.254: LED2.1 17.66,19.02 12.29,19.02 12.25,19.05 U3.11
NRST: length 19.3
  Top Layer w0.254: 9.87,21.68 10.25,21.31 U3.7 10.25,18.89 10.5,18.64 10.51,18.64 11.65,17.49 11.65,16.48 12.03,16.1 R11.1 12.38,16.21 C9.1
  Bottom Layer w0.254: v1(9.75,21.68) 9.57,21.86 8.11,21.86 7.08,22.89 7.08,23.84 3.52,27.4 H1.4
SWCLK: length 6.2
  Top Layer w0.254: U3.37 5.2,27.25 5.05,27.4 5.05,29.33 4.79,29.58 3.25,29.58 2.89,29.94 H1.3
SWDIO: length 9
  Top Layer w0.254: U3.34 8.25,29.53 7.84,29.94 3.4,29.94 3.01,30.32 3.01,31.21 H1.2
USB-VBUS: length 61.6
  Top Layer w0.254: Q1.3 20.83,37.38 C2.2 ; v2(12.41,31.72) 12.4,31.73 USB1.2 ; USB1.11 7.6,31.6 v2(7.59,31.59) ; U1.3 v2(17.11,14.95)
  Bottom Layer w0.254: 13.18,31.34 13.18,21.18 17.11,17.24 v2(17.11,14.95) ; 13.18,31.34 12.79,31.34 v2(12.41,31.72) ; 13.18,31.34 13.43,31.59 15.84,31.59 17.37,33.11 17.37,38.83 ; 17.37,38.83 19.78,38.83 v2(20.79,37.81) ; 17.37,38.83 4.79,38.83 4.28,38.32 4.28,32.61 5.3,31.59 v2(7.59,31.59)
$1N217: length 9.9
  Top Layer w0.254: R1.1 3.78,32.1 5.05,30.83 7.97,30.83 8.25,31.11 USB1.10
$1N218: length 7
  Top Layer w0.254: R2.1 16.04,32.3 14.83,31.08 11.52,31.08 11.25,31.36 USB1.4
$3N372: length 1.7
  Top Layer w0.254: LED1.2 20.26,22.93 R3.1
$3N375: length 1.7
  Top Layer w0.254: R4.1 18.38,22.9 LED2.2
$3N378: length 1.4
  Top Layer w0.254: R5.1 23.54,34.16 LED3.2
$5N578: length 6.1
  Top Layer w0.254: U3.5 9.25,17.45 X1.3 7.55,15.75 C7.2
$5N591: length 9.2
  Top Layer w0.254: C8.2 9.78,14.03 X1.1 11.02,15.26 11.02,17.49 10.38,18.13 9.75,18.13 U3.6
$5N836: length 3.6
  Top Layer w0.254: R9.2 2.89,23.33 3.8,24.25 U3.43
$5N839: length 3.3
  Top Layer w0.254: R10.2 2.81,24.73 5.73,24.73 U3.42

## Copper pours and planes (outline as drawn; the poured copper is in the pictures)
GND on Top Layer: -10.7,42.89 40.35,42.89 40.35,-2.19 -10.7,-2.19
GND on Bottom Layer: -3.34,45.31 35.78,45.31 35.78,-5.75 -3.34,-5.75

Small or netless copper shapes (teardrops, artwork), in the pictures only: 152 on Top Layer, 28 on Bottom Layer

## Text on the board
Bottom Silkscreen Layer: 扩展板-003 V2024.07.01 | BY 何亚红 | candleLight: / -修改为Type-C口
Top Silkscreen Layer: BOOT | IO | CK | RST | CAN | H | L | 120Ω | candleLight | 终端电阻
